# Altium schematic sheet USB3300.SchDoc
size 149 x 100 mm; SheetNumber: 6; SheetTotal: 13
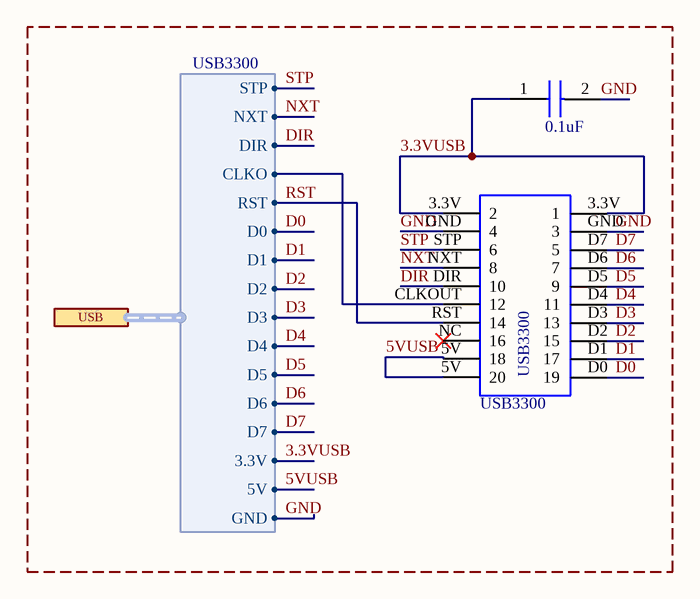
[diagram p0: USB3300.SchDoc]

## Parts
CAPUSB3V  0.1uF  [CAP0805]
USB3300  USB3300  [USB3300]

## Ports
USB (harness USB3300, see CONTROL_PCB_MAIN[5B], STM32[5B])

## Harnesses
USB3300: D2, D3, D4, D5, D0, D1, DIR, CLKO, RST, STP, NXT, D7, 3.3V, 5V, GND, D6

## Nets
3.3VUSB: CAPUSB3V.1 USB3300.3.3V(2) ; port USB.3.3V
5VUSB: USB3300.5V(20) ; port USB.5V
D0: USB3300.D0(19) ; port USB.D0
D1: USB3300.D1(17) ; port USB.D1
D2: USB3300.D2(15) ; port USB.D2
D3: USB3300.D3(13) ; port USB.D3
D4: USB3300.D4(11) ; port USB.D4
D5: USB3300.D5(9) ; port USB.D5
D6: USB3300.D6(7) ; port USB.D6
D7: USB3300.D7(5) ; port USB.D7
DIR: USB3300.DIR(10) ; port USB.DIR
GND: CAPUSB3V.2 USB3300.GND(4) ; port USB.GND
NXT: USB3300.NXT(8) ; port USB.NXT
RST: USB3300.RST(14) ; port USB.RST
STP: USB3300.STP(6) ; port USB.STP
NetUSB3300_CLKOUT: USB3300.CLKOUT(12) ; port USB.CLKO

Not connected (* = marked no-connect by the designer): USB3300 NC(16)*

## Library data of the parts
CAPUSB3V = CAP0805: CAP-SMD0805
USB3300 = USB3300: USB3300HS